# Altium schematic sheet CH1_CH2.SchDoc
size A4; SheetNumber: 2; SheetTotal: 5
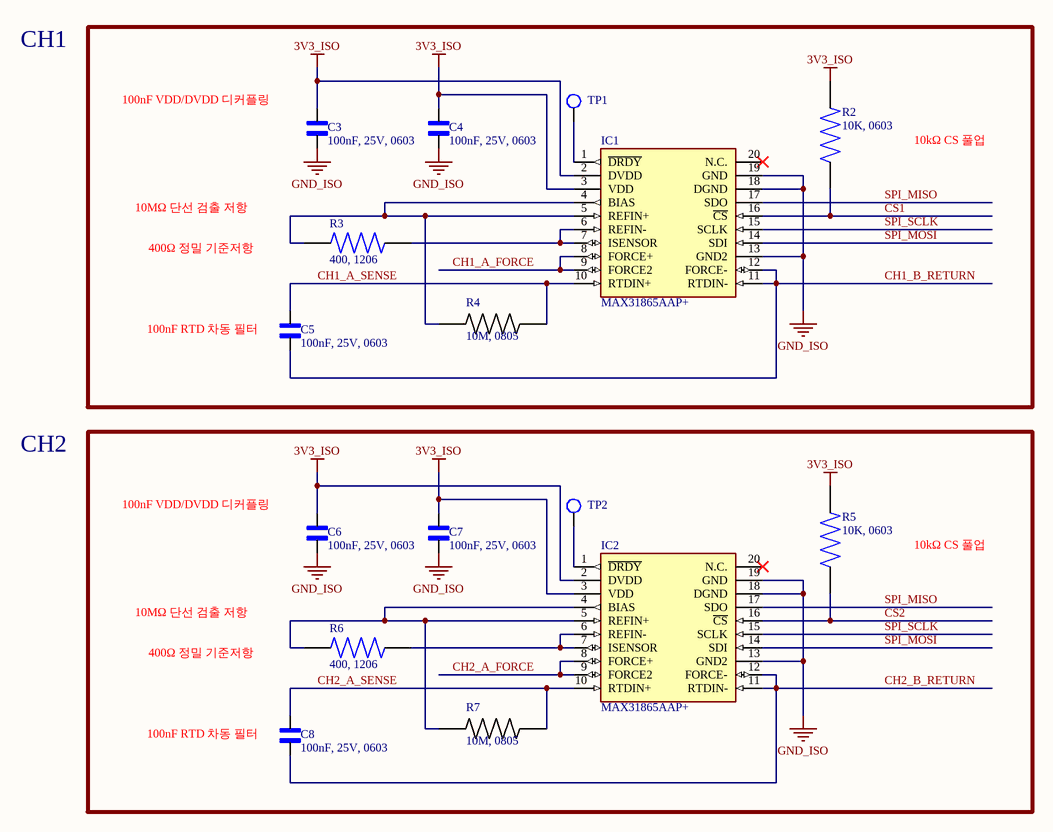
[diagram p0: CH1_CH2.SchDoc]

## Parts
C3  100nF, 25V, 0603  [CAPC1608X90N]
C4  100nF, 25V, 0603  [CAPC1608X90N]
C5  100nF, 25V, 0603  [CAPC1608X90N]
C6  100nF, 25V, 0603  [CAPC1608X90N]
C7  100nF, 25V, 0603  [CAPC1608X90N]
C8  100nF, 25V, 0603  [CAPC1608X90N]
IC1  MAX31865AAP+  [SOP65P778X199-20N]
IC2  MAX31865AAP+  [SOP65P778X199-20N]
R2  10K, 0603  [RESC1607X60N]
R3  400, 1206  [RESC3116X65N]
R4  10M, 0805  [*RESC2012X60N]
R5  10K, 0603  [RESC1607X60N]
R6  400, 1206  [RESC3116X65N]
R7  10M, 0805  [*RESC2012X60N]
TP1  TEST POINT  [TESTPOINT]  (value not drawn)
TP2  TEST POINT  [TESTPOINT]  (value not drawn)

## Nets
3V3_ISO: C3.2 C4.2 C6.2 C7.2 IC1.2(DVDD) IC1.3(VDD) IC2.2(DVDD) IC2.3(VDD) R2.2 R5.2
GND_ISO: C3.1 C4.1 C6.1 C7.1 IC1.13(GND2) IC1.18(DGND) IC1.19(GND) IC2.13(GND2) IC2.18(DGND) IC2.19(GND)
CH1_A_FORCE: IC1.8(FORCE+) IC1.9(FORCE2)
CH1_A_SENSE: C5.2 IC1.10(RTDIN+) R4.2
CH1_B_RETURN: C5.1 IC1.11(RTDIN-) IC1.12(FORCE-)
CH2_A_FORCE: IC2.8(FORCE+) IC2.9(FORCE2)
CH2_A_SENSE: C8.2 IC2.10(RTDIN+) R7.2
CH2_B_RETURN: C8.1 IC2.11(RTDIN-) IC2.12(FORCE-)
CS1: IC1.16(~{CS}) R2.1
CS2: IC2.16(~{CS}) R5.1
SPI_MISO: IC1.17(SDO) IC2.17(SDO)
SPI_MOSI: IC1.14(SDI) IC2.14(SDI)
SPI_SCLK: IC1.15(SCLK) IC2.15(SCLK)
NetIC1_1: IC1.1(~{DRDY}) TP1.1
NetIC1_4: IC1.4(BIAS) IC1.5(REFIN+) R3.1 R4.1
NetIC1_6: IC1.6(REFIN-) IC1.7(ISENSOR) R3.2
NetIC2_1: IC2.1(~{DRDY}) TP2.1
NetIC2_4: IC2.4(BIAS) IC2.5(REFIN+) R6.1 R7.1
NetIC2_6: IC2.6(REFIN-) IC2.7(ISENSOR) R6.2

Not connected (* = marked no-connect by the designer): IC1 20(N.C.)*; IC2 20(N.C.)*

## Notes on the sheet
- CH1
- (near C3) 100nF VDD/DVDD 디커플링
- 10kΩ CS 풀업
- 10MΩ 단선 검출 저항
- 400Ω 정밀 기준저항
- (near C5) 100nF RTD 차동 필터
- CH2
- (near C6) 100nF VDD/DVDD 디커플링
- (near C8) 100nF RTD 차동 필터

## Library data of the parts
C3-C8 = CL10B104KA8VPJC: Multilayer Ceramic Capacitors MLCC - SMD/SMT; MF: Samsung Electro-Mechanics; SnapEDA_Link: https://www.snapeda.com/parts/CL10B104KA8VPJC/Samsung/view-part/?ref=snap; Package: SMD-2 Samsung; Value: *; MP: CL10B104KA8VPJC; Check_prices: https://www.snapeda.com/parts/CL10B104KA8VPJC/Samsung/view-part/?ref=eda
IC1 IC2 = MAX31865AAP+: Integrated Circuit; Manufacturer_Name: Analog Devices; Datasheet Link: https://www.analog.com/MAX31865/datasheet; Height: 1.99mm; Manufacturer_Part_Number: MAX31865AAP+; Mouser Part Number: 700-MAX31865AAP+; Mouser Price/Stock: https://www.mouser.co.uk/ProductDetail/Analog-Devices-Maxim-Integrated/MAX31865AAP%2b?qs=PVVDbbWpW3IB0xqHe0DjLw%3D%3D; Arrow Part Number: MAX31865AAP+; Arrow Price/Stock: https://www.arrow.com/en/products/max31865aap/analog-devices.html?utm_currency=USD&region=europe
R2 R5 = RC0603FR-0710KL: 10 kOhms ±1% 0.1W, 1/10W Chip Resistor 0603 (1608 Metric) Moisture Resistant Thick Film; MF: Yageo Corporation; MP: RC0603FR0710KL; SnapEDA_Link: https://www.snapeda.com/parts/RC0603FR0710KL/Yageo/view-part/?ref=snap; Package: 0603-2 YAGEO; Value: *; Check_prices: https://www.snapeda.com/parts/RC0603FR0710KL/Yageo/view-part/?ref=eda
R3 R6 = RT1206BRD07400RL: 400 Ohms Â±0.1% 0.25W, 1/4W Chip Resistor 1206 (3216 Metric) - Thin Film; MF: Yageo; SnapEDA_Link: https://www.snapeda.com/parts/RT1206BRD07400RL/Yageo/view-part/?ref=snap; Package: 3116 Yageo; Value: *; MP: RT1206BRD07400RL; Check_prices: https://www.snapeda.com/parts/RT1206BRD07400RL/Yageo/view-part/?ref=eda
R4 R7 = AC0805FR-1010ML: 10MΩ, ±1%, 125mW, 0805, AEC-Q200; SnapEDA_Link: https://www.snapeda.com/parts/AC0805FR-1010ML/Yageo/view-part/?ref=snap; Check_prices: https://www.snapeda.com/parts/AC0805FR-1010ML/Yageo/view-part/?ref=eda; Value: *